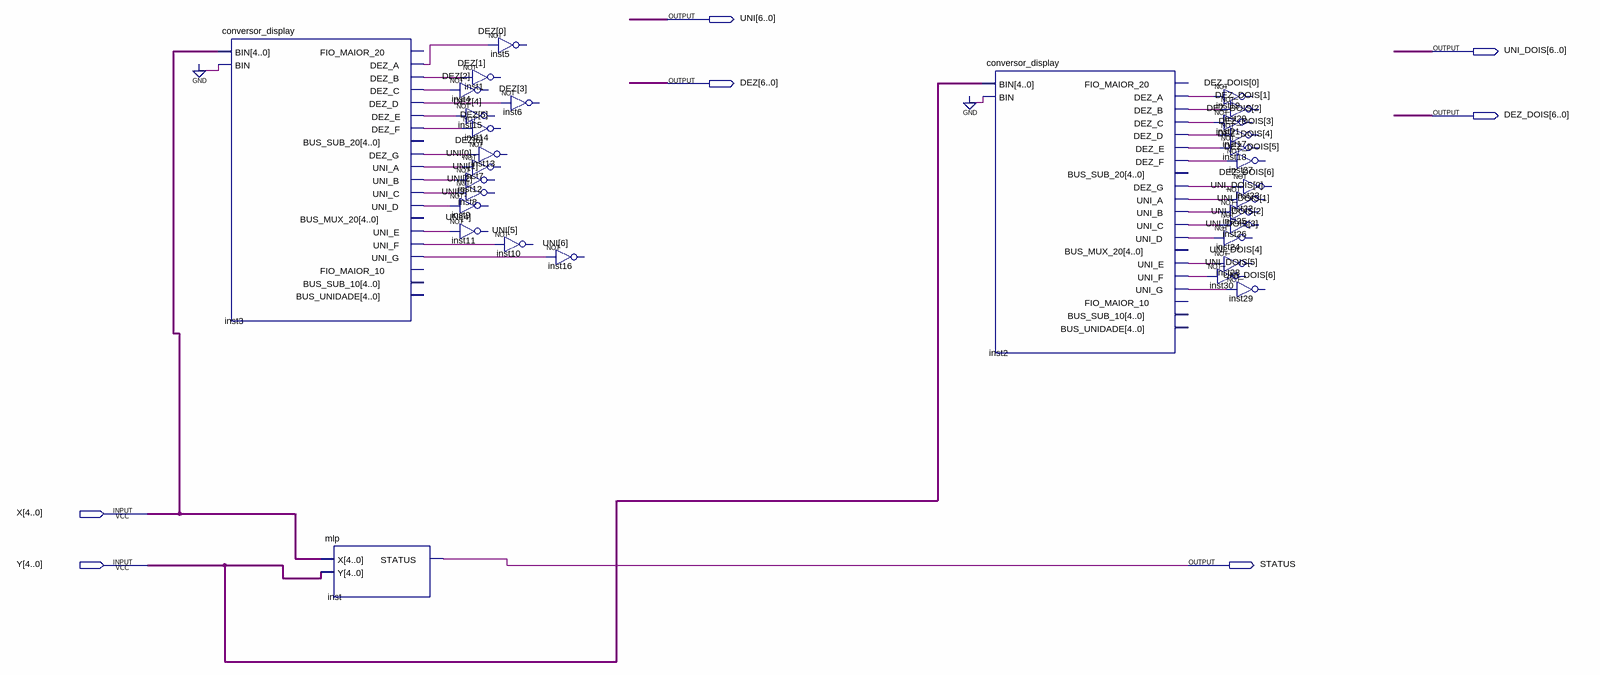
[diagram p0: schematic sheet]
// Quartus schematic rede_neural_projeto.bdf as structural Verilog: 31 symbols, 7 pins
module rede_neural_projeto (
  input  [4:0] X,
  input  [4:0] Y,
  output [6:0] UNI,
  output [6:0] UNI_DOIS,
  output [6:0] DEZ,
  output [6:0] DEZ_DOIS,
  output STATUS
);

  conversor_display inst3 (
    .BIN({X, 1'b0}), .DEZ_A(DEZ[0]), .DEZ_B(DEZ[1]), .DEZ_C(DEZ[2]), .DEZ_D(DEZ[3]), .DEZ_E(DEZ[4]),
    .DEZ_F(DEZ[5]), .DEZ_G(DEZ[6]), .UNI_A(UNI[0]), .UNI_B(UNI[1]), .UNI_C(UNI[2]), .UNI_D(UNI[3]),
    .UNI_E(UNI[4]), .UNI_F(UNI[5]), .UNI_G(UNI[6]));  // open: FIO_MAIOR_20, BUS_SUB_20, BUS_MUX_20, FIO_MAIOR_10, BUS_SUB_10, BUS_UNIDADE
  mlp inst (.X(X), .Y(Y), .STATUS(STATUS));
  // NOT inst4 has open pins: IN=DEZ[2], OUT=open
  // NOT inst9 has open pins: IN=UNI[3], OUT=open
  // NOT inst11 has open pins: IN=UNI[4], OUT=open
  // NOT inst5 has open pins: IN=DEZ[0], OUT=open
  // NOT inst1 has open pins: IN=DEZ[1], OUT=open
  // NOT inst6 has open pins: IN=DEZ[3], OUT=open
  // NOT inst15 has open pins: IN=DEZ[4], OUT=open
  // NOT inst14 has open pins: IN=DEZ[5], OUT=open
  // NOT inst13 has open pins: IN=DEZ[6], OUT=open
  // NOT inst7 has open pins: IN=UNI[0], OUT=open
  // NOT inst12 has open pins: IN=UNI[1], OUT=open
  // NOT inst8 has open pins: IN=UNI[2], OUT=open
  // NOT inst10 has open pins: IN=UNI[5], OUT=open
  // NOT inst16 has open pins: IN=UNI[6], OUT=open
  conversor_display inst2 (
    .BIN({Y, 1'b0}), .DEZ_A(DEZ_DOIS[0]), .DEZ_B(DEZ_DOIS[1]), .DEZ_C(DEZ_DOIS[2]), .DEZ_D(DEZ_DOIS[3]),
    .DEZ_E(DEZ_DOIS[4]), .DEZ_F(DEZ_DOIS[5]), .DEZ_G(DEZ_DOIS[6]), .UNI_A(UNI_DOIS[0]), .UNI_B(UNI_DOIS[1]),
    .UNI_C(UNI_DOIS[2]), .UNI_D(UNI_DOIS[3]), .UNI_E(UNI_DOIS[4]), .UNI_F(UNI_DOIS[5]), .UNI_G(UNI_DOIS[6]));  // open: FIO_MAIOR_20, BUS_SUB_20, BUS_MUX_20, FIO_MAIOR_10, BUS_SUB_10, BUS_UNIDADE
  // NOT inst19 has open pins: IN=DEZ_DOIS[0], OUT=open
  // NOT inst20 has open pins: IN=DEZ_DOIS[1], OUT=open
  // NOT inst21 has open pins: IN=DEZ_DOIS[2], OUT=open
  // NOT inst17 has open pins: IN=DEZ_DOIS[3], OUT=open
  // NOT inst18 has open pins: IN=DEZ_DOIS[4], OUT=open
  // NOT inst25 has open pins: IN=UNI_DOIS[1], OUT=open
  // NOT inst26 has open pins: IN=UNI_DOIS[2], OUT=open
  // NOT inst24 has open pins: IN=UNI_DOIS[3], OUT=open
  // NOT inst28 has open pins: IN=UNI_DOIS[4], OUT=open
  // NOT inst30 has open pins: IN=UNI_DOIS[5], OUT=open
  // NOT inst27 has open pins: IN=DEZ_DOIS[5], OUT=open
  // NOT inst23 has open pins: IN=DEZ_DOIS[6], OUT=open
  // NOT inst22 has open pins: IN=UNI_DOIS[0], OUT=open
  // NOT inst29 has open pins: IN=UNI_DOIS[6], OUT=open
endmodule
